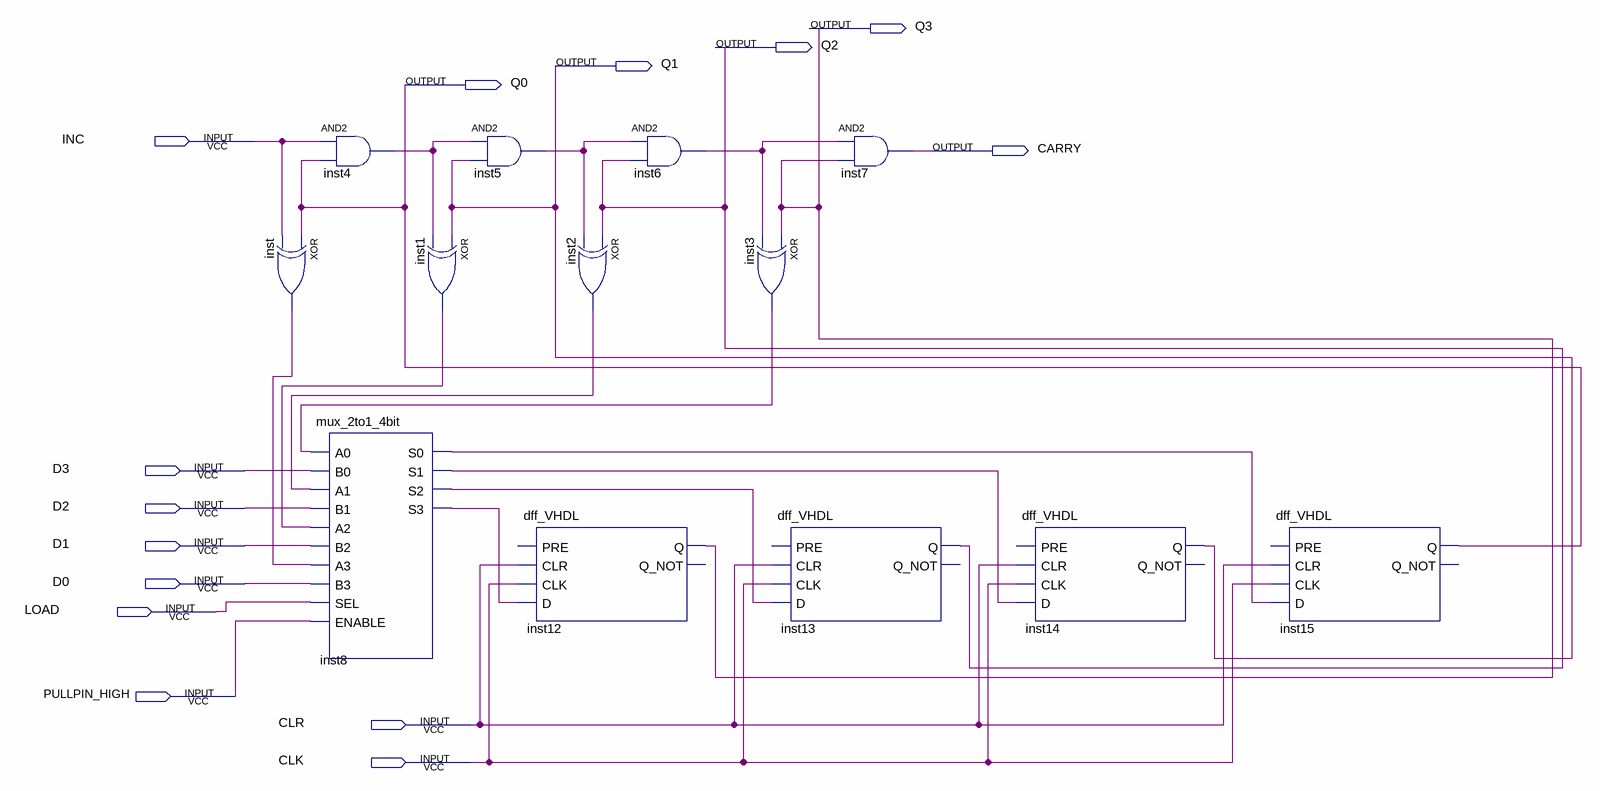
[diagram p0: schematic sheet]
// Quartus schematic SynchUpCount_4bit.bdf as structural Verilog: 13 symbols, 14 pins
module SynchUpCount_4bit (
  input  INC,
  input  D3,
  input  D2,
  input  D1,
  input  D0,
  input  LOAD,
  input  PULLPIN_HIGH,
  input  CLR,
  input  CLK,
  output Q3,
  output Q2,
  output Q1,
  output Q0,
  output CARRY
);

  wire inst1_out, inst2_out, inst3_out, inst4_out, inst5_out, inst6_out, inst8_s0, inst8_s1, inst8_s2,
       inst8_s3, inst_out;

  and inst4 (inst4_out, INC, Q0);
  xor inst (inst_out, Q0, INC);
  mux_2to1_4bit inst8 (
    .A0(inst3_out), .B0(D3), .A1(inst2_out), .B1(D2), .A2(inst1_out), .B2(D1), .A3(inst_out), .B3(D0),
    .SEL(LOAD), .ENABLE(PULLPIN_HIGH), .S0(inst8_s0), .S1(inst8_s1), .S2(inst8_s2), .S3(inst8_s3));
  and inst5 (inst5_out, inst4_out, Q1);
  xor inst1 (inst1_out, Q1, inst4_out);
  dff_VHDL inst12 (.CLR(CLR), .CLK(CLK), .D(inst8_s3), .Q(Q3));  // open: PRE, Q_NOT
  xor inst2 (inst2_out, Q2, inst5_out);
  and inst6 (inst6_out, inst5_out, Q2);
  xor inst3 (inst3_out, Q3, inst6_out);
  dff_VHDL inst13 (.CLR(CLR), .CLK(CLK), .D(inst8_s2), .Q(Q2));  // open: PRE, Q_NOT
  and inst7 (CARRY, inst6_out, Q3);
  dff_VHDL inst14 (.CLR(CLR), .CLK(CLK), .D(inst8_s1), .Q(Q1));  // open: PRE, Q_NOT
  dff_VHDL inst15 (.CLR(CLR), .CLK(CLK), .D(inst8_s0), .Q(Q0));  // open: PRE, Q_NOT
endmodule
